# Altium schematic sheet MCU.SchDoc
size A4
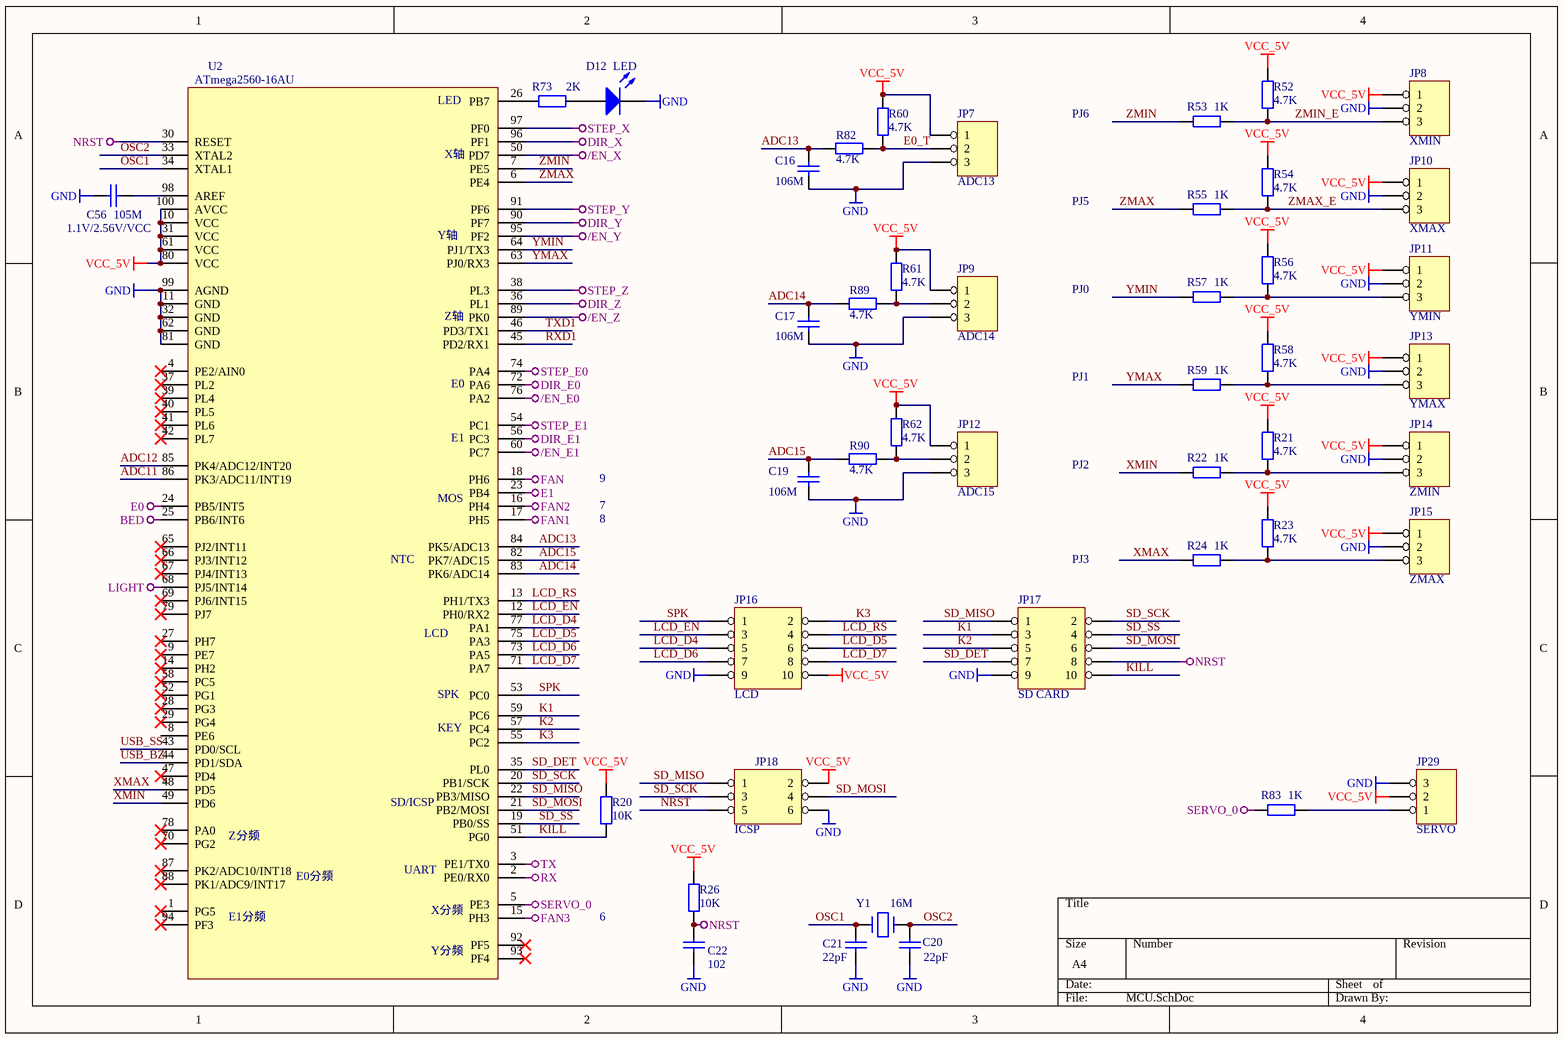
[diagram p0: MCU.SchDoc]

## Parts
C16  106M  [0603(C)]
C17  106M  [0603(C)]
C19  106M  [0603(C)]
C20  22pF  [0603(C)]
C21  22pF  [0603(C)]
C22  102  [0603(C)]
C56  105M  [0603(C)]
D12  LED  [LED-SMD-0805]
JP7  ADC13  [XH2.54-3P]
JP8  XMIN  [XH2.54-3P]
JP9  ADC14  [XH2.54-3P]
JP10  XMAX  [XH2.54-3P]
JP11  YMIN  [XH2.54-3P]
JP12  ADC15  [XH2.54-3P]
JP13  YMAX  [XH2.54-3P]
JP14  ZMIN  [XH2.54-3P]
JP15  ZMAX  [XH2.54-3P]
JP16  LCD  [IDC10-BASE]
JP17  SD CARD  [IDC10-BASE]
JP18  ICSP  [IDC6X2.54]
JP29  SERVO  [XH2.54-3P]
R20  10K  [0603(R)]
R21  4.7K  [0603(R)]
R22  1K  [0603(R)]
R23  4.7K  [0603(R)]
R24  1K  [0603(R)]
R26  10K  [0603(R)]
R52  4.7K  [0603(R)]
R53  1K  [0603(R)]
R54  4.7K  [0603(R)]
R55  1K  [0603(R)]
R56  4.7K  [0603(R)]
R57  1K  [0603(R)]
R58  4.7K  [0603(R)]
R59  1K  [0603(R)]
R60  4.7K  [0603(R)]
R61  4.7K  [0603(R)]
R62  4.7K  [0603(R)]
R73  2K  [0603(R)]
R82  4.7K  [0603(R)]
R83  1K  [0603(R)]
R89  4.7K  [0603(R)]
R90  4.7K  [0603(R)]
U2  ATmega2560-16AU  [LQFP100]
Y1  16M  [CRYS-SMD-5032-2P]

## Nets
/EN_E0: U2.76(PA2)
/EN_E1: U2.60(PC7)
/EN_X: U2.50(PD7)
/EN_Y: U2.95(PF2)
/EN_Z: U2.89(PK0)
BED: U2.25(PB6/INT6)
DIR_E0: U2.72(PA6)
DIR_E1: U2.56(PC3)
DIR_X: U2.96(PF1)
DIR_Y: U2.90(PF7)
DIR_Z: U2.36(PL1)
E0: U2.24(PB5/INT5)
E1: U2.23(PB4)
FAN: U2.18(PH6)
FAN1: U2.17(PH5)
FAN2: U2.16(PH4)
FAN3: U2.15(PH3)
GND: C16.1 C17.1 C19.1 C20.2 C21.2 C22.2 C56.2 D12.2(K) JP7.3 JP8.2 JP9.3 JP10.2 JP11.2 JP12.3 JP13.2 JP14.2 JP15.2 JP16.9 JP17.9 JP18.6 JP29.3 U2.11(GND) U2.32(GND) U2.62(GND) U2.81(GND) U2.99(AGND)
LIGHT: U2.68(PJ5/INT14)
NRST: C22.1 JP17.8 JP18.5 R26.1 U2.30(RESET)
RX: U2.2(PE0/RX0)
SERVO_0: R83.2 U2.5(PE3)
STEP_E0: U2.74(PA4)
STEP_E1: U2.54(PC1)
STEP_X: U2.97(PF0)
STEP_Y: U2.91(PF6)
STEP_Z: U2.38(PL3)
TX: U2.3(PE1/TX0)
VCC_5V: JP7.1 JP8.1 JP9.1 JP10.1 JP11.1 JP12.1 JP13.1 JP14.1 JP15.1 JP16.10 JP18.2 JP29.2 R20.2 R21.1 R23.1 R26.2 R52.1 R54.1 R56.1 R58.1 R60.1 R61.1 R62.1 U2.10(VCC) U2.31(VCC) U2.61(VCC) U2.80(VCC) U2.100(AVCC)
ADC11: U2.86(PK3/ADC11/INT19)
ADC12: U2.85(PK4/ADC12/INT20)
ADC13: C16.2 R82.1 U2.84(PK5/ADC13)
ADC14: C17.2 R89.1 U2.83(PK6/ADC14)
ADC15: C19.2 R90.1 U2.82(PK7/ADC15)
E0_T: JP7.2 R60.2 R82.2
K1: JP17.3 U2.59(PC6)
K2: JP17.5 U2.57(PC4)
K3: JP16.2 U2.55(PC2)
KILL: JP17.10 R20.1 U2.51(PG0)
LCD_D4: JP16.5 U2.77(PA1)
LCD_D5: JP16.6 U2.75(PA3)
LCD_D6: JP16.7 U2.73(PA5)
LCD_D7: JP16.8 U2.71(PA7)
LCD_EN: JP16.3 U2.12(PH0/RX2)
LCD_RS: JP16.4 U2.13(PH1/TX3)
OSC1: C21.1 U2.34(XTAL1) Y1.1
OSC2: C20.1 U2.33(XTAL2) Y1.2
RXD1: U2.45(PD2/RX1)
SD_DET: JP17.7 U2.35(PL0)
SD_MISO: JP17.1 JP18.1 U2.22(PB3/MISO)
SD_MOSI: JP17.6 JP18.4 U2.21(PB2/MOSI)
SD_SCK: JP17.2 JP18.3 U2.20(PB1/SCK)
SD_SS: JP17.4 U2.19(PB0/SS)
SPK: JP16.1 U2.53(PC0)
TXD1: U2.46(PD3/TX1)
USB_BZ: U2.44(PD1/SDA)
USB_SS: U2.43(PD0/SCL)
XMAX: R24.2 U2.48(PD5)
XMIN: R22.2 U2.49(PD6)
YMAX: R59.2 U2.63(PJ0/RX3)
YMIN: R57.2 U2.64(PJ1/TX3)
ZMAX: R55.2 U2.6(PE4)
ZMAX_E: JP10.3 R54.2 R55.1
ZMIN: R53.2 U2.7(PE5)
ZMIN_E: JP8.3 R52.2 R53.1
NetC56_1: C56.1 U2.98(AREF)
NetD12_1: D12.1(A) R73.2
NetJP9_2: JP9.2 R61.2 R89.2
NetJP11_3: JP11.3 R56.2 R57.1
NetJP12_2: JP12.2 R62.2 R90.2
NetJP13_3: JP13.3 R58.2 R59.1
NetJP14_3: JP14.3 R21.2 R22.1
NetJP15_3: JP15.3 R23.2 R24.1
NetJP29_1: JP29.1 R83.1
NetR73_1: R73.1 U2.26(PB7)

Not connected (* = marked no-connect by the designer): U2 1(PG5)* 4(PE2/AIN0)* 8(PE6) 9(PE7)* 14(PH2)* 27(PH7)* 28(PG3)* 29(PG4)* 37(PL2)* 39(PL4)* 40(PL5)* 41(PL6)* 42(PL7)* 47(PD4)* 52(PG1)* 58(PC5)* 65(PJ2/INT11)* 66(PJ3/INT12)* 67(PJ4/INT13)* 69(PJ6/INT15)* 70(PG2)* 78(PA0)* 79(PJ7)* 87(PK2/ADC10/INT18)* 88(PK1/ADC9/INT17)* 92(PF5)* 93(PF4)* 94(PF3)*

## Notes on the sheet
- PJ6
- 1.1V/2.56V/VCC
- PJ5
- PJ0
- PJ1
- 9
- 7
- 8
- PJ2
- PJ3
- 6
- (in symbol ATmega2560) LED; X轴; Y轴; Z轴; E0; E1; MOS; NTC; LCD; SPK; KEY; SD/ICSP; Z分频; UART; E0分频; X分频; E1分频; Y分频

## Library data of the parts
C16 C17 C19 C56 = Cap: Capacitor; Value: 104; Published: 8-Jun-2000; LatestRevisionDate: 17-Jul-2002; LatestRevisionNote: Re-released for DXP Platform.; PackageReference: RAD-0.3; Publisher: Altium Limited; PackageDescription: Radial Cap, Thru-Hole; 2 Leads; 0.3 in Pin Spacing
C20-C22 = Cap: Capacitor; Value: 30pF; Published: 8-Jun-2000; LatestRevisionDate: 17-Jul-2002; LatestRevisionNote: Re-released for DXP Platform.; PackageReference: RAD-0.3; Publisher: Altium Limited; PackageDescription: Radial Cap, Thru-Hole; 2 Leads; 0.3 in Pin Spacing
D12 = LED1: Typical RED GaAs LED; Published: 8-Jun-2000; LatestRevisionDate: 08-Jul-2005; LatestRevisionNote: Mech Layer 1 removed.; PackageReference: LED-1; Publisher: Altium Limited; PackageDescription: LED; 2 Leads
JP7-JP15 JP29 = HEADER 3
JP16 JP17 = HEADER 5X2
JP18 = HEADER 3X2
R20 R21 R23 R26 R52 R54 R56 R58 R60-R62 R82 R89 R90 = Res2: 1K; Published: 8-Jun-2000; LatestRevisionDate: 17-Jul-2002; LatestRevisionNote: Re-released for DXP Platform.; PackageReference: AXIAL-0.4; Publisher: Altium Limited; PackageDescription: Axial Device, Thru-Hole; 2 Leads; 0.4 in Pin Spacing; Value: 1K
R22 R24 R53 R55 R57 R59 R83 = Res2: Published: 8-Jun-2000; LatestRevisionDate: 17-Jul-2002; LatestRevisionNote: Re-released for DXP Platform.; PackageReference: AXIAL-0.4; Publisher: Altium Limited; PackageDescription: Axial Device, Thru-Hole; 2 Leads; 0.4 in Pin Spacing; Value: 1K
R73 = Res2: Resistor
U2 = ATmega2560
Y1 = CRYSTAL